# Altium schematic sheet POT 10x8.SchDoc
size D
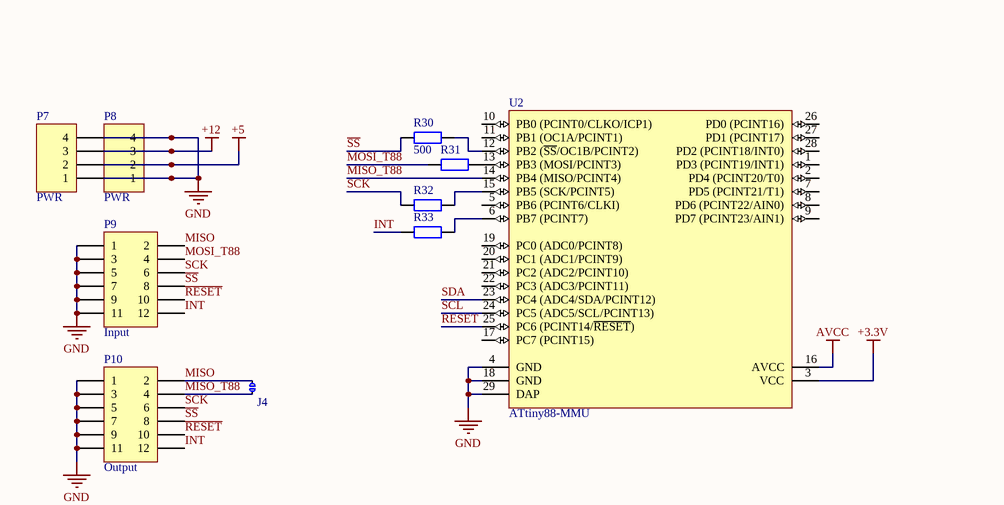
[diagram p0: POT 10x8.SchDoc, top left]
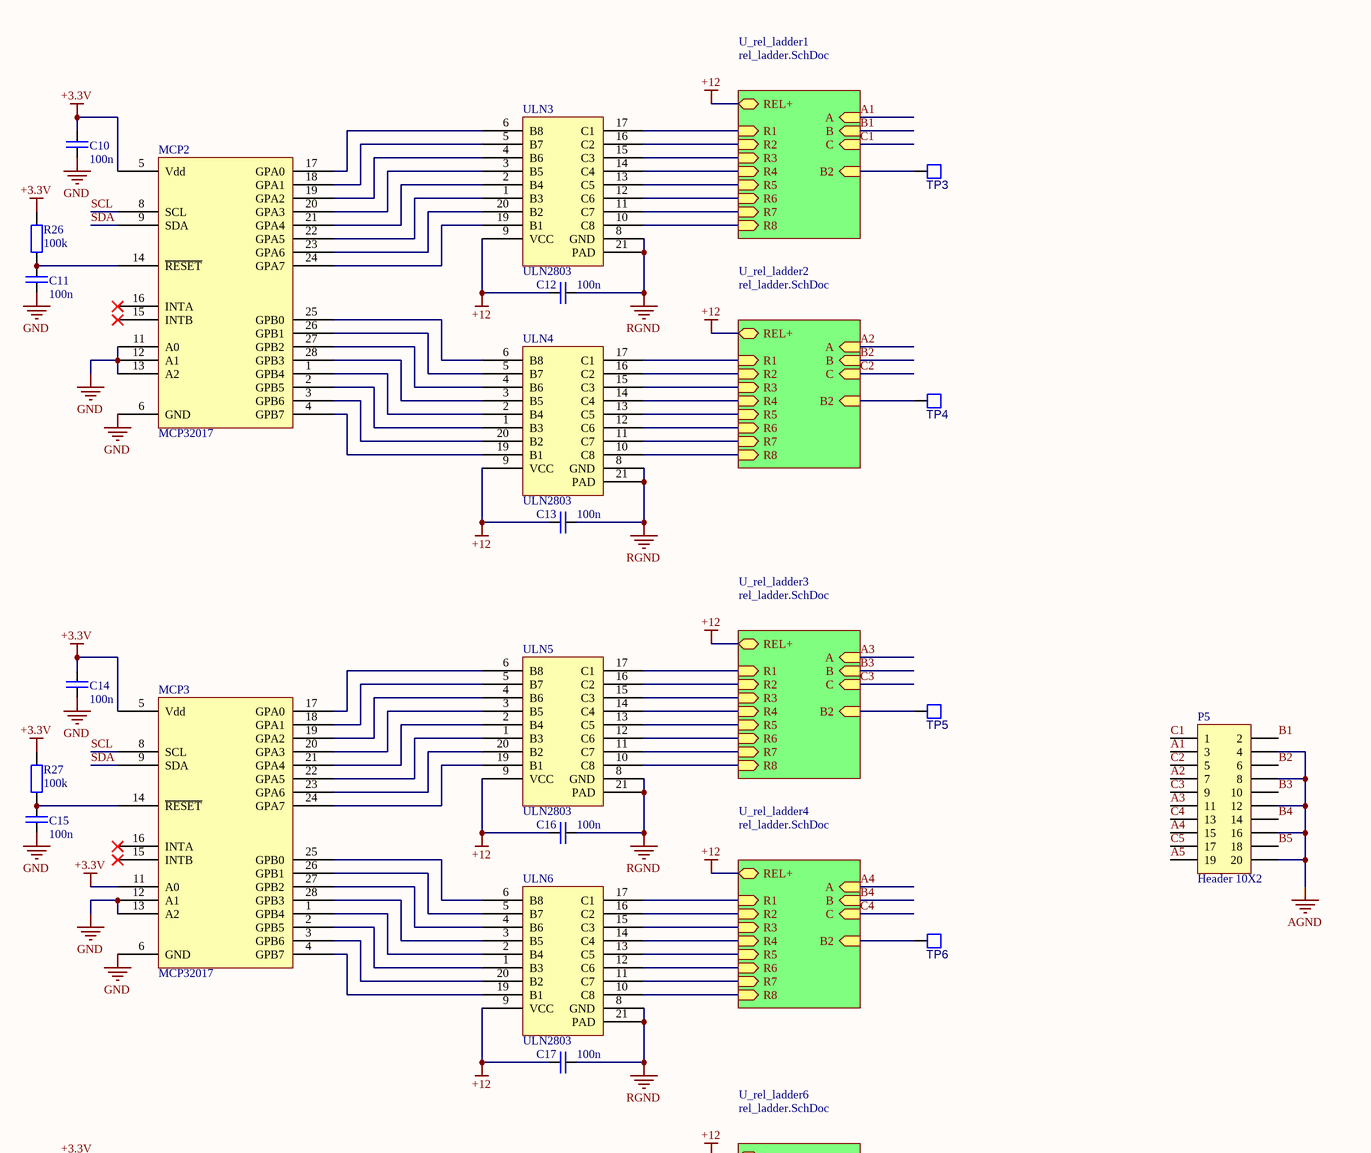
[diagram p1: POT 10x8.SchDoc, top right]
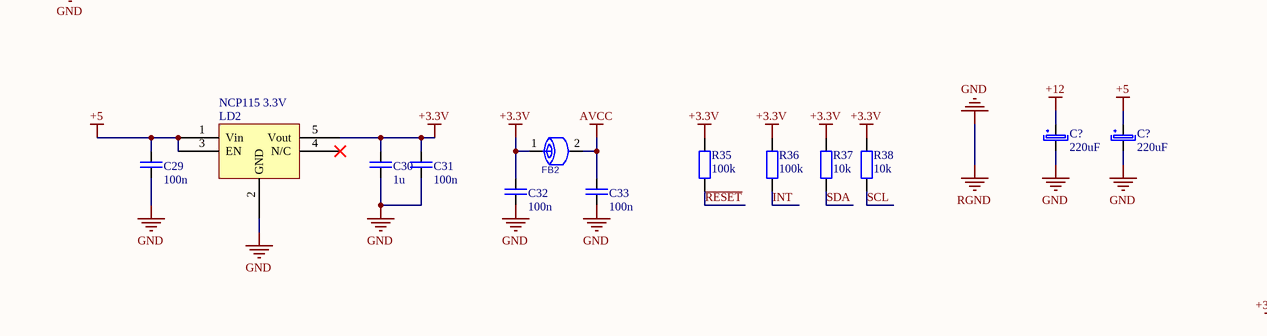
[diagram p2: POT 10x8.SchDoc, bottom left]
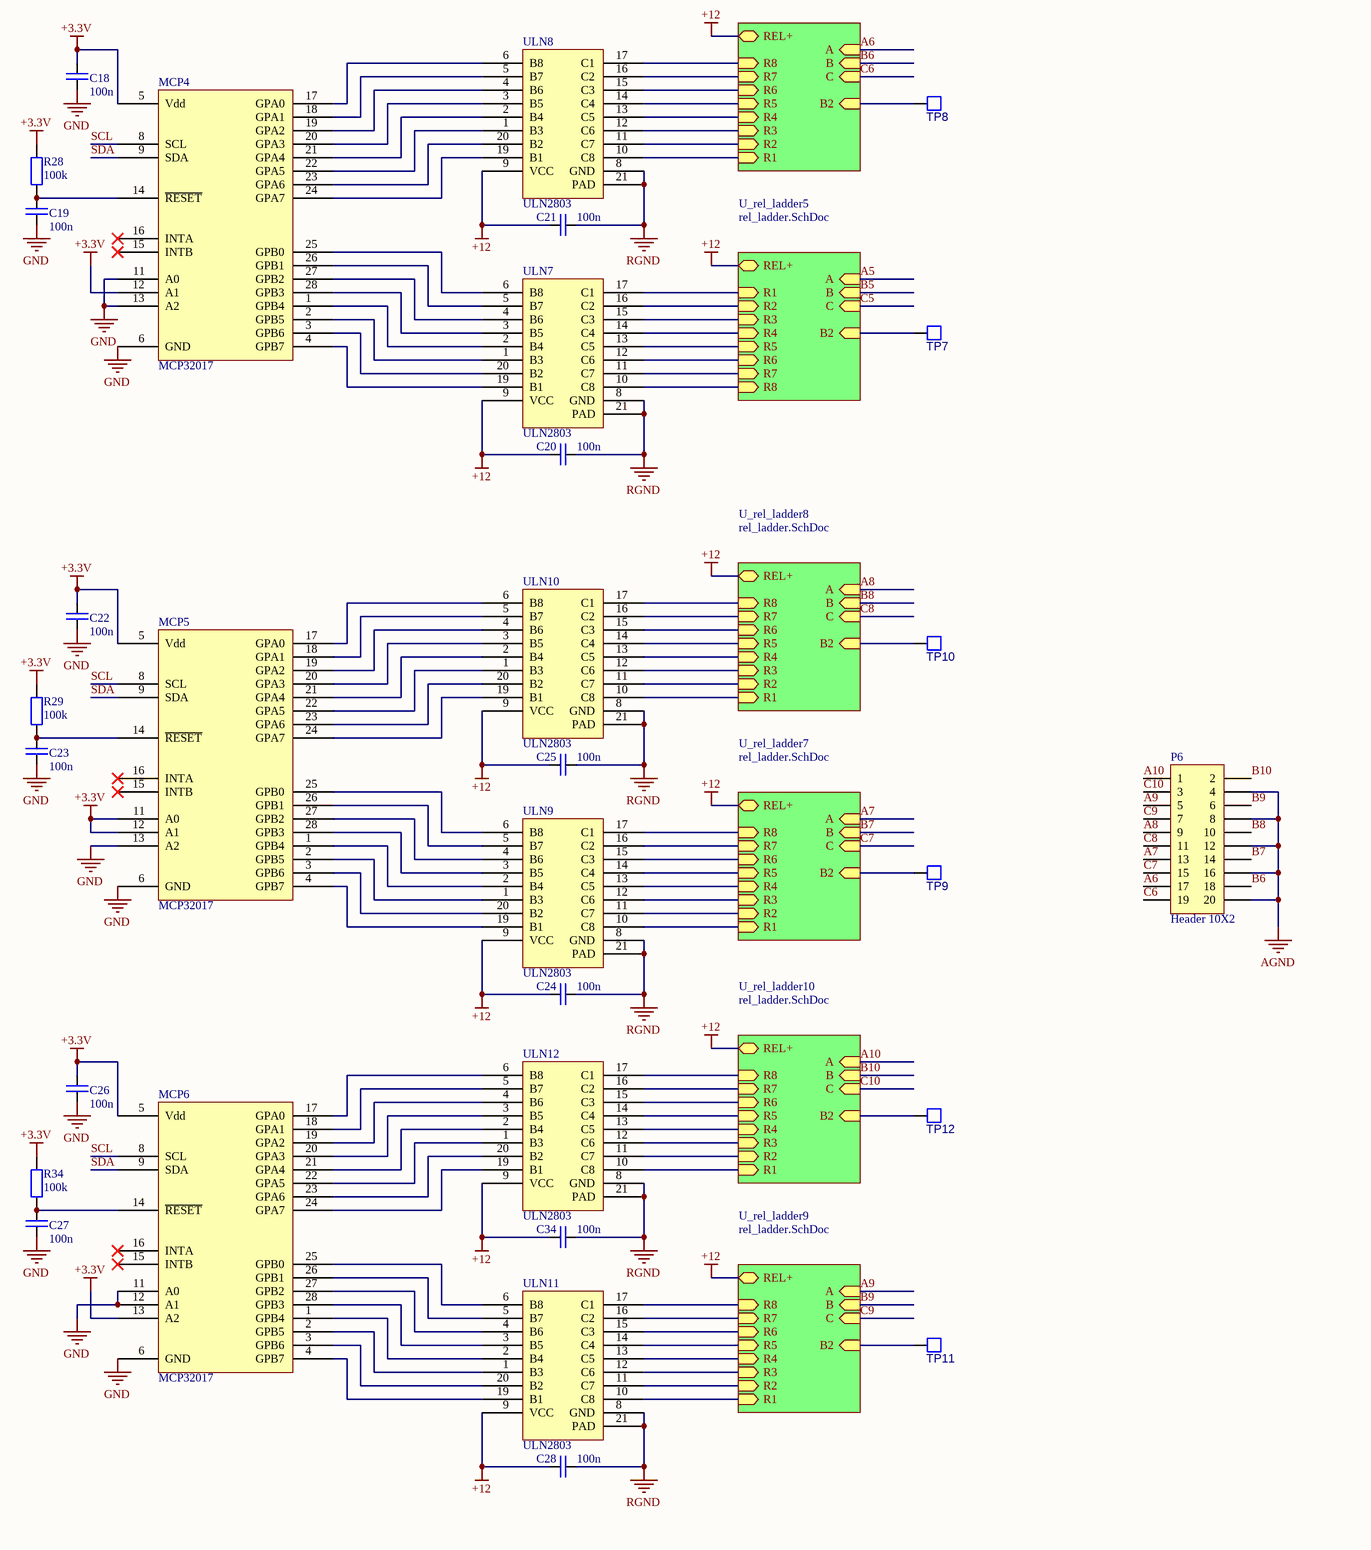
[diagram p3: POT 10x8.SchDoc, bottom right]

## Parts
(Parts that share a designator on the sheet are numbered #1, #2 ... from top to bottom, then left to right.)
C10  100n  [R1005_0402i_L]
C11  100n  [R1005_0402i_L]
C12  100n  [R1005_0402i_L]
C13  100n  [R1005_0402i_L]
C14  100n  [R1005_0402i_L]
C15  100n  [R1005_0402i_L]
C16  100n  [R1005_0402i_L]
C17  100n  [R1005_0402i_L]
C18  100n  [R1005_0402i_L]
C19  100n  [R1005_0402i_L]
C20  100n  [R1005_0402i_L]
C21  100n  [R1005_0402i_L]
C22  100n  [R1005_0402i_L]
C23  100n  [R1005_0402i_L]
C24  100n  [R1005_0402i_L]
C25  100n  [R1005_0402i_L]
C26  100n  [R1005_0402i_L]
C27  100n  [R1005_0402i_L]
C28  100n  [R1005_0402i_L]
C29  100n  [R1005_0402i_L]
C30  1u  [C1608_0603I_L]
C31  100n  [R1005_0402i_L]
C32  100n  [R1005_0402i_L]
C33  100n  [R1005_0402i_L]
C34  100n  [R1005_0402i_L]
C?#1  220uF  [C AlElko 5x11 R2]
C?#2  220uF  [C AlElko 5x11 R2]
FB2  FERITTE BEAD  [R1608_0603I_L]  (value not drawn)
J4  Terminator  [solderJumper]  (value not drawn)
LD2  NCP115 3.3V  [TSOP95P280X110-6L]
MCP2  MCP32017  [MCP23017 QFN]
MCP3  MCP32017  [MCP23017 QFN]
MCP4  MCP32017  [MCP23017 QFN]
MCP5  MCP32017  [MCP23017 QFN]
MCP6  MCP32017  [MCP23017 QFN]
P5  Header 10X2  [HDR2X10]
P6  Header 10X2  [HDR2X10]
P7  PWR  [HDR1X4]
P8  PWR  [HDR1X4]
P9  Input  [1.27mm SMD conn]
P10  Output  [1.27mm SMD conn]
R26  100k  [R1005_0402i_L]
R27  100k  [R1005_0402i_L]
R28  100k  [R1005_0402i_L]
R29  100k  [R1005_0402i_L]
R30  500  [R1005_0402i_L]
R31  500  [R1005_0402i_L]  (value not drawn)
R32  500  [R1005_0402i_L]  (value not drawn)
R33  500  [R1005_0402i_L]  (value not drawn)
R34  100k  [R1005_0402i_L]
R35  100k  [R1005_0402i_L]
R36  100k  [R1005_0402i_L]
R37  10k  [R1005_0402i_L]
R38  10k  [R1005_0402i_L]
TP3  PAD  [PAD_CIRC_HOLE]  (value not drawn)
TP4  PAD  [PAD_CIRC_HOLE]  (value not drawn)
TP5  PAD  [PAD_CIRC_HOLE]  (value not drawn)
TP6  PAD  [PAD_CIRC_HOLE]  (value not drawn)
TP7  PAD  [PAD_CIRC_HOLE]  (value not drawn)
TP8  PAD  [PAD_CIRC_HOLE]  (value not drawn)
TP9  PAD  [PAD_CIRC_HOLE]  (value not drawn)
TP10  PAD  [PAD_CIRC_HOLE]  (value not drawn)
TP11  PAD  [PAD_CIRC_HOLE]  (value not drawn)
TP12  PAD  [PAD_CIRC_HOLE]  (value not drawn)
U2  ATtiny88-MMU  [28M1_N]
ULN3  ULN2803  [QFN127P600-8N]
ULN4  ULN2803  [QFN127P600-8N]
ULN5  ULN2803  [QFN127P600-8N]
ULN6  ULN2803  [QFN127P600-8N]
ULN7  ULN2803  [QFN127P600-8N]
ULN8  ULN2803  [QFN127P600-8N]
ULN9  ULN2803  [QFN127P600-8N]
ULN10  ULN2803  [QFN127P600-8N]
ULN11  ULN2803  [QFN127P600-8N]
ULN12  ULN2803  [QFN127P600-8N]

## Sub-sheets
U_rel_ladder1 = rel_ladder.SchDoc: B (in), C (in), A (in), REL+ (bidir), R1 (in), R2 (in), R3 (in), R4 (in), R5 (in), R6 (in), R7 (in), R8 (in), B2 (in)
U_rel_ladder2 = rel_ladder.SchDoc: B (in), C (in), A (in), REL+ (bidir), R1 (in), R2 (in), R3 (in), R4 (in), R5 (in), R6 (in), R7 (in), R8 (in), B2 (in)
U_rel_ladder3 = rel_ladder.SchDoc: B (in), C (in), A (in), REL+ (bidir), R1 (in), R2 (in), R3 (in), R4 (in), R5 (in), R6 (in), R7 (in), R8 (in), B2 (in)
U_rel_ladder4 = rel_ladder.SchDoc: B (in), C (in), A (in), REL+ (bidir), R1 (in), R2 (in), R3 (in), R4 (in), R5 (in), R6 (in), R7 (in), R8 (in), B2 (in)
U_rel_ladder5 = rel_ladder.SchDoc: B (in), C (in), A (in), REL+ (bidir), R1 (in), R2 (in), R3 (in), R4 (in), R5 (in), R6 (in), R7 (in), R8 (in), B2 (in)
U_rel_ladder6 = rel_ladder.SchDoc: B (in), C (in), A (in), REL+ (bidir), R1 (in), R2 (in), R3 (in), R4 (in), R5 (in), R6 (in), R7 (in), R8 (in), B2 (in)
U_rel_ladder7 = rel_ladder.SchDoc: B (in), C (in), A (in), REL+ (bidir), R1 (in), R2 (in), R3 (in), R4 (in), R5 (in), R6 (in), R7 (in), R8 (in), B2 (in)
U_rel_ladder8 = rel_ladder.SchDoc: B (in), C (in), A (in), REL+ (bidir), R1 (in), R2 (in), R3 (in), R4 (in), R5 (in), R6 (in), R7 (in), R8 (in), B2 (in)
U_rel_ladder9 = rel_ladder.SchDoc: B (in), C (in), A (in), REL+ (bidir), R1 (in), R2 (in), R3 (in), R4 (in), R5 (in), R6 (in), R7 (in), R8 (in), B2 (in)
U_rel_ladder10 = rel_ladder.SchDoc: B (in), C (in), A (in), REL+ (bidir), R1 (in), R2 (in), R3 (in), R4 (in), R5 (in), R6 (in), R7 (in), R8 (in), B2 (in)

## Nets
+3.3V: C10.2 C14.2 C18.2 C22.2 C26.2 C30.1 C31.1 C32.1 FB2.1 LD2.5(Vout) MCP2.5(Vdd) MCP3.5(Vdd) MCP3.11(A0) MCP4.5(Vdd) MCP4.12(A1) MCP5.5(Vdd) MCP5.11(A0) MCP5.12(A1) MCP6.5(Vdd) MCP6.13(A2) R26.1 R27.1 R28.1 R29.1 R34.1 R35.1 R36.1 R37.1 R38.1 U2.3(VCC)
+5: C29.1 C?#2.1 LD2.1(Vin) LD2.3(EN) P7.2 P8.2
+12: C12.1 C13.1 C16.1 C17.1 C20.1 C21.1 C24.1 C25.1 C28.1 C34.1 C?#1.1 P7.3 P8.3 ULN3.9(VCC) ULN4.9(VCC) ULN5.9(VCC) ULN6.9(VCC) ULN7.9(VCC) ULN8.9(VCC) ULN9.9(VCC) ULN10.9(VCC) ULN11.9(VCC) ULN12.9(VCC) ; sheet U_rel_ladder1/REL+, sheet U_rel_ladder2/REL+, sheet U_rel_ladder3/REL+, sheet U_rel_ladder4/REL+, sheet U_rel_ladder5/REL+, sheet U_rel_ladder6/REL+, sheet U_rel_ladder7/REL+, sheet U_rel_ladder8/REL+, sheet U_rel_ladder9/REL+, sheet U_rel_ladder10/REL+
AGND: P5.4 P5.8 P5.12 P5.16 P5.20 P6.4 P6.8 P6.12 P6.16 P6.20
AVCC: C33.1 FB2.2 U2.16(AVCC)
GND: C10.1 C11.1 C12.2 C13.2 C14.1 C15.1 C16.2 C17.2 C18.1 C19.1 C20.2 C21.2 C22.1 C23.1 C24.2 C25.2 C26.1 C27.1 C28.2 C29.2 C30.2 C31.2 C32.2 C33.2 C34.2 C?#1.2 C?#2.2 LD2.2(GND) MCP2.6(GND) MCP2.11(A0) MCP2.12(A1) MCP2.13(A2) MCP3.6(GND) MCP3.12(A1) MCP3.13(A2) MCP4.6(GND) MCP4.11(A0) MCP4.13(A2) MCP5.6(GND) MCP5.13(A2) MCP6.6(GND) MCP6.11(A0) MCP6.12(A1) P7.1 P7.4 P8.1 P8.4 P9.1 P9.3 P9.5 P9.7 P9.9 P9.11 P10.1 P10.3 P10.5 P10.7 P10.9 P10.11 U2.4(GND) U2.18(GND) U2.29(DAP) ULN3.8(GND) ULN3.21(PAD) ULN4.8(GND) ULN4.21(PAD) ULN5.8(GND) ULN5.21(PAD) ULN6.8(GND) ULN6.21(PAD) ULN7.8(GND) ULN7.21(PAD) ULN8.8(GND) ULN8.21(PAD) ULN9.8(GND) ULN9.21(PAD) ULN10.8(GND) ULN10.21(PAD) ULN11.8(GND) ULN11.21(PAD) ULN12.8(GND) ULN12.21(PAD)  [also labelled RGND]
A1: P5.3 ; sheet U_rel_ladder1/A
A2: P5.7 ; sheet U_rel_ladder2/A
A3: P5.11 ; sheet U_rel_ladder3/A
A4: P5.15 ; sheet U_rel_ladder4/A
A5: P5.19 ; sheet U_rel_ladder5/A
A6: P6.17 ; sheet U_rel_ladder6/A
A7: P6.13 ; sheet U_rel_ladder7/A
A8: P6.9 ; sheet U_rel_ladder8/A
A9: P6.5 ; sheet U_rel_ladder9/A
A10: P6.1 ; sheet U_rel_ladder10/A
B1: P5.2 ; sheet U_rel_ladder1/B
B2: P5.6 ; sheet U_rel_ladder2/B
B3: P5.10 ; sheet U_rel_ladder3/B
B4: P5.14 ; sheet U_rel_ladder4/B
B5: P5.18 ; sheet U_rel_ladder5/B
B6: P6.18 ; sheet U_rel_ladder6/B
B7: P6.14 ; sheet U_rel_ladder7/B
B8: P6.10 ; sheet U_rel_ladder8/B
B9: P6.6 ; sheet U_rel_ladder9/B
B10: P6.2 ; sheet U_rel_ladder10/B
C1: P5.1 ; sheet U_rel_ladder1/C
C2: P5.5 ; sheet U_rel_ladder2/C
C3: P5.9 ; sheet U_rel_ladder3/C
C4: P5.13 ; sheet U_rel_ladder4/C
C5: P5.17 ; sheet U_rel_ladder5/C
C6: P6.19 ; sheet U_rel_ladder6/C
C7: P6.15 ; sheet U_rel_ladder7/C
C8: P6.11 ; sheet U_rel_ladder8/C
C9: P6.7 ; sheet U_rel_ladder9/C
C10: P6.3 ; sheet U_rel_ladder10/C
INT: P9.12 P10.12 R33.1 R36.2
MISO: J4.2 P9.2 P10.2
MISO_T88: J4.1 P10.4 U2.14(PB4_(MISO/PCINT4))
MOSI_T88: P9.4 R31.1
~{RESET}: P9.10 P10.10 R35.2 U2.25(PC6_(PCINT14/~{RESET}))
~{SS}: P9.8 P10.8 R30.1
SCK: P9.6 P10.6 R32.1
SCL: MCP2.8(SCL) MCP3.8(SCL) MCP4.8(SCL) MCP5.8(SCL) MCP6.8(SCL) R38.2 U2.24(PC5_(ADC5/SCL/PCINT13))
SDA: MCP2.9(SDA) MCP3.9(SDA) MCP4.9(SDA) MCP5.9(SDA) MCP6.9(SDA) R37.2 U2.23(PC4_(ADC4/SDA/PCINT12))
NetC11_2: C11.2 MCP2.14(~{RESET}) R26.2
NetC15_2: C15.2 MCP3.14(~{RESET}) R27.2
NetC19_2: C19.2 MCP4.14(~{RESET}) R28.2
NetC23_2: C23.2 MCP5.14(~{RESET}) R29.2
NetC27_2: C27.2 MCP6.14(~{RESET}) R34.2
NetMCP2_1: MCP2.1(GPB4) ULN4.2(B4)
NetMCP2_2: MCP2.2(GPB5) ULN4.1(B3)
NetMCP2_3: MCP2.3(GPB6) ULN4.20(B2)
NetMCP2_4: MCP2.4(GPB7) ULN4.19(B1)
NetMCP2_17: MCP2.17(GPA0) ULN3.6(B8)
NetMCP2_18: MCP2.18(GPA1) ULN3.5(B7)
NetMCP2_19: MCP2.19(GPA2) ULN3.4(B6)
NetMCP2_20: MCP2.20(GPA3) ULN3.3(B5)
NetMCP2_21: MCP2.21(GPA4) ULN3.2(B4)
NetMCP2_22: MCP2.22(GPA5) ULN3.1(B3)
NetMCP2_23: MCP2.23(GPA6) ULN3.20(B2)
NetMCP2_24: MCP2.24(GPA7) ULN3.19(B1)
NetMCP2_25: MCP2.25(GPB0) ULN4.6(B8)
NetMCP2_26: MCP2.26(GPB1) ULN4.5(B7)
NetMCP2_27: MCP2.27(GPB2) ULN4.4(B6)
NetMCP2_28: MCP2.28(GPB3) ULN4.3(B5)
NetMCP3_1: MCP3.1(GPB4) ULN6.2(B4)
NetMCP3_2: MCP3.2(GPB5) ULN6.1(B3)
NetMCP3_3: MCP3.3(GPB6) ULN6.20(B2)
NetMCP3_4: MCP3.4(GPB7) ULN6.19(B1)
NetMCP3_17: MCP3.17(GPA0) ULN5.6(B8)
NetMCP3_18: MCP3.18(GPA1) ULN5.5(B7)
NetMCP3_19: MCP3.19(GPA2) ULN5.4(B6)
NetMCP3_20: MCP3.20(GPA3) ULN5.3(B5)
NetMCP3_21: MCP3.21(GPA4) ULN5.2(B4)
NetMCP3_22: MCP3.22(GPA5) ULN5.1(B3)
NetMCP3_23: MCP3.23(GPA6) ULN5.20(B2)
NetMCP3_24: MCP3.24(GPA7) ULN5.19(B1)
NetMCP3_25: MCP3.25(GPB0) ULN6.6(B8)
NetMCP3_26: MCP3.26(GPB1) ULN6.5(B7)
NetMCP3_27: MCP3.27(GPB2) ULN6.4(B6)
NetMCP3_28: MCP3.28(GPB3) ULN6.3(B5)
NetMCP4_1: MCP4.1(GPB4) ULN7.2(B4)
NetMCP4_2: MCP4.2(GPB5) ULN7.1(B3)
NetMCP4_3: MCP4.3(GPB6) ULN7.20(B2)
NetMCP4_4: MCP4.4(GPB7) ULN7.19(B1)
NetMCP4_17: MCP4.17(GPA0) ULN8.6(B8)
NetMCP4_18: MCP4.18(GPA1) ULN8.5(B7)
NetMCP4_19: MCP4.19(GPA2) ULN8.4(B6)
NetMCP4_20: MCP4.20(GPA3) ULN8.3(B5)
NetMCP4_21: MCP4.21(GPA4) ULN8.2(B4)
NetMCP4_22: MCP4.22(GPA5) ULN8.1(B3)
NetMCP4_23: MCP4.23(GPA6) ULN8.20(B2)
NetMCP4_24: MCP4.24(GPA7) ULN8.19(B1)
NetMCP4_25: MCP4.25(GPB0) ULN7.6(B8)
NetMCP4_26: MCP4.26(GPB1) ULN7.5(B7)
NetMCP4_27: MCP4.27(GPB2) ULN7.4(B6)
NetMCP4_28: MCP4.28(GPB3) ULN7.3(B5)
NetMCP5_1: MCP5.1(GPB4) ULN9.2(B4)
NetMCP5_2: MCP5.2(GPB5) ULN9.1(B3)
NetMCP5_3: MCP5.3(GPB6) ULN9.20(B2)
NetMCP5_4: MCP5.4(GPB7) ULN9.19(B1)
NetMCP5_17: MCP5.17(GPA0) ULN10.6(B8)
NetMCP5_18: MCP5.18(GPA1) ULN10.5(B7)
NetMCP5_19: MCP5.19(GPA2) ULN10.4(B6)
NetMCP5_20: MCP5.20(GPA3) ULN10.3(B5)
NetMCP5_21: MCP5.21(GPA4) ULN10.2(B4)
NetMCP5_22: MCP5.22(GPA5) ULN10.1(B3)
NetMCP5_23: MCP5.23(GPA6) ULN10.20(B2)
NetMCP5_24: MCP5.24(GPA7) ULN10.19(B1)
NetMCP5_25: MCP5.25(GPB0) ULN9.6(B8)
NetMCP5_26: MCP5.26(GPB1) ULN9.5(B7)
NetMCP5_27: MCP5.27(GPB2) ULN9.4(B6)
NetMCP5_28: MCP5.28(GPB3) ULN9.3(B5)
NetMCP6_1: MCP6.1(GPB4) ULN11.2(B4)
NetMCP6_2: MCP6.2(GPB5) ULN11.1(B3)
NetMCP6_3: MCP6.3(GPB6) ULN11.20(B2)
NetMCP6_4: MCP6.4(GPB7) ULN11.19(B1)
NetMCP6_17: MCP6.17(GPA0) ULN12.6(B8)
NetMCP6_18: MCP6.18(GPA1) ULN12.5(B7)
NetMCP6_19: MCP6.19(GPA2) ULN12.4(B6)
NetMCP6_20: MCP6.20(GPA3) ULN12.3(B5)
NetMCP6_21: MCP6.21(GPA4) ULN12.2(B4)
NetMCP6_22: MCP6.22(GPA5) ULN12.1(B3)
NetMCP6_23: MCP6.23(GPA6) ULN12.20(B2)
NetMCP6_24: MCP6.24(GPA7) ULN12.19(B1)
NetMCP6_25: MCP6.25(GPB0) ULN11.6(B8)
NetMCP6_26: MCP6.26(GPB1) ULN11.5(B7)
NetMCP6_27: MCP6.27(GPB2) ULN11.4(B6)
NetMCP6_28: MCP6.28(GPB3) ULN11.3(B5)
NetR30_2: R30.2 U2.12(PB2_(~{SS}/OC1B/PCINT2))
NetR31_2: R31.2 U2.13(PB3_(MOSI/PCINT3))
NetR32_2: R32.2 U2.15(PB5_(SCK/PCINT5))
NetR33_2: R33.2 U2.6(PB7_(PCINT7))
NetTP3_1: TP3.1 ; sheet U_rel_ladder1/B2
NetTP4_1: TP4.1 ; sheet U_rel_ladder2/B2
NetTP5_1: TP5.1 ; sheet U_rel_ladder3/B2
NetTP6_1: TP6.1 ; sheet U_rel_ladder4/B2
NetTP7_1: TP7.1 ; sheet U_rel_ladder5/B2
NetTP8_1: TP8.1 ; sheet U_rel_ladder6/B2
NetTP9_1: TP9.1 ; sheet U_rel_ladder7/B2
NetTP10_1: TP10.1 ; sheet U_rel_ladder8/B2
NetTP11_1: TP11.1 ; sheet U_rel_ladder9/B2
NetTP12_1: TP12.1 ; sheet U_rel_ladder10/B2
NetULN3_10: ULN3.10(C8) ; sheet U_rel_ladder1/R8
NetULN3_11: ULN3.11(C7) ; sheet U_rel_ladder1/R7
NetULN3_12: ULN3.12(C6) ; sheet U_rel_ladder1/R6
NetULN3_13: ULN3.13(C5) ; sheet U_rel_ladder1/R5
NetULN3_14: ULN3.14(C4) ; sheet U_rel_ladder1/R4
NetULN3_15: ULN3.15(C3) ; sheet U_rel_ladder1/R3
NetULN3_16: ULN3.16(C2) ; sheet U_rel_ladder1/R2
NetULN3_17: ULN3.17(C1) ; sheet U_rel_ladder1/R1
NetULN4_10: ULN4.10(C8) ; sheet U_rel_ladder2/R8
NetULN4_11: ULN4.11(C7) ; sheet U_rel_ladder2/R7
NetULN4_12: ULN4.12(C6) ; sheet U_rel_ladder2/R6
NetULN4_13: ULN4.13(C5) ; sheet U_rel_ladder2/R5
NetULN4_14: ULN4.14(C4) ; sheet U_rel_ladder2/R4
NetULN4_15: ULN4.15(C3) ; sheet U_rel_ladder2/R3
NetULN4_16: ULN4.16(C2) ; sheet U_rel_ladder2/R2
NetULN4_17: ULN4.17(C1) ; sheet U_rel_ladder2/R1
NetULN5_10: ULN5.10(C8) ; sheet U_rel_ladder3/R8
NetULN5_11: ULN5.11(C7) ; sheet U_rel_ladder3/R7
NetULN5_12: ULN5.12(C6) ; sheet U_rel_ladder3/R6
NetULN5_13: ULN5.13(C5) ; sheet U_rel_ladder3/R5
NetULN5_14: ULN5.14(C4) ; sheet U_rel_ladder3/R4
NetULN5_15: ULN5.15(C3) ; sheet U_rel_ladder3/R3
NetULN5_16: ULN5.16(C2) ; sheet U_rel_ladder3/R2
NetULN5_17: ULN5.17(C1) ; sheet U_rel_ladder3/R1
NetULN6_10: ULN6.10(C8) ; sheet U_rel_ladder4/R8
NetULN6_11: ULN6.11(C7) ; sheet U_rel_ladder4/R7
NetULN6_12: ULN6.12(C6) ; sheet U_rel_ladder4/R6
NetULN6_13: ULN6.13(C5) ; sheet U_rel_ladder4/R5
NetULN6_14: ULN6.14(C4) ; sheet U_rel_ladder4/R4
NetULN6_15: ULN6.15(C3) ; sheet U_rel_ladder4/R3
NetULN6_16: ULN6.16(C2) ; sheet U_rel_ladder4/R2
NetULN6_17: ULN6.17(C1) ; sheet U_rel_ladder4/R1
NetULN7_10: ULN7.10(C8) ; sheet U_rel_ladder5/R8
NetULN7_11: ULN7.11(C7) ; sheet U_rel_ladder5/R7
NetULN7_12: ULN7.12(C6) ; sheet U_rel_ladder5/R6
NetULN7_13: ULN7.13(C5) ; sheet U_rel_ladder5/R5
NetULN7_14: ULN7.14(C4) ; sheet U_rel_ladder5/R4
NetULN7_15: ULN7.15(C3) ; sheet U_rel_ladder5/R3
NetULN7_16: ULN7.16(C2) ; sheet U_rel_ladder5/R2
NetULN7_17: ULN7.17(C1) ; sheet U_rel_ladder5/R1
NetULN8_10: ULN8.10(C8) ; sheet U_rel_ladder6/R1
NetULN8_11: ULN8.11(C7) ; sheet U_rel_ladder6/R2
NetULN8_12: ULN8.12(C6) ; sheet U_rel_ladder6/R3
NetULN8_13: ULN8.13(C5) ; sheet U_rel_ladder6/R4
NetULN8_14: ULN8.14(C4) ; sheet U_rel_ladder6/R5
NetULN8_15: ULN8.15(C3) ; sheet U_rel_ladder6/R6
NetULN8_16: ULN8.16(C2) ; sheet U_rel_ladder6/R7
NetULN8_17: ULN8.17(C1) ; sheet U_rel_ladder6/R8
NetULN9_10: ULN9.10(C8) ; sheet U_rel_ladder7/R1
NetULN9_11: ULN9.11(C7) ; sheet U_rel_ladder7/R2
NetULN9_12: ULN9.12(C6) ; sheet U_rel_ladder7/R3
NetULN9_13: ULN9.13(C5) ; sheet U_rel_ladder7/R4
NetULN9_14: ULN9.14(C4) ; sheet U_rel_ladder7/R5
NetULN9_15: ULN9.15(C3) ; sheet U_rel_ladder7/R6
NetULN9_16: ULN9.16(C2) ; sheet U_rel_ladder7/R7
NetULN9_17: ULN9.17(C1) ; sheet U_rel_ladder7/R8
NetULN10_10: ULN10.10(C8) ; sheet U_rel_ladder8/R1
NetULN10_11: ULN10.11(C7) ; sheet U_rel_ladder8/R2
NetULN10_12: ULN10.12(C6) ; sheet U_rel_ladder8/R3
NetULN10_13: ULN10.13(C5) ; sheet U_rel_ladder8/R4
NetULN10_14: ULN10.14(C4) ; sheet U_rel_ladder8/R5
NetULN10_15: ULN10.15(C3) ; sheet U_rel_ladder8/R6
NetULN10_16: ULN10.16(C2) ; sheet U_rel_ladder8/R7
NetULN10_17: ULN10.17(C1) ; sheet U_rel_ladder8/R8
NetULN11_10: ULN11.10(C8) ; sheet U_rel_ladder9/R1
NetULN11_11: ULN11.11(C7) ; sheet U_rel_ladder9/R2
NetULN11_12: ULN11.12(C6) ; sheet U_rel_ladder9/R3
NetULN11_13: ULN11.13(C5) ; sheet U_rel_ladder9/R4
NetULN11_14: ULN11.14(C4) ; sheet U_rel_ladder9/R5
NetULN11_15: ULN11.15(C3) ; sheet U_rel_ladder9/R6
NetULN11_16: ULN11.16(C2) ; sheet U_rel_ladder9/R7
NetULN11_17: ULN11.17(C1) ; sheet U_rel_ladder9/R8
NetULN12_10: ULN12.10(C8) ; sheet U_rel_ladder10/R1
NetULN12_11: ULN12.11(C7) ; sheet U_rel_ladder10/R2
NetULN12_12: ULN12.12(C6) ; sheet U_rel_ladder10/R3
NetULN12_13: ULN12.13(C5) ; sheet U_rel_ladder10/R4
NetULN12_14: ULN12.14(C4) ; sheet U_rel_ladder10/R5
NetULN12_15: ULN12.15(C3) ; sheet U_rel_ladder10/R6
NetULN12_16: ULN12.16(C2) ; sheet U_rel_ladder10/R7
NetULN12_17: ULN12.17(C1) ; sheet U_rel_ladder10/R8

Not connected (* = marked no-connect by the designer): LD2 4(N/C)*; MCP2 15(INTB)* 16(INTA)*; MCP3 15(INTB)* 16(INTA)*; MCP4 15(INTB)* 16(INTA)*; MCP5 15(INTB)* 16(INTA)*; MCP6 15(INTB)* 16(INTA)*; U2 1(PD3_(PCINT19/INT1)) 2(PD4_(PCINT20/T0)) 5(PB6_(PCINT6/CLKI)) 7(PD5_(PCINT21/T1)) 8(PD6_(PCINT22/AIN0)) 9(PD7_(PCINT23/AIN1)) 10(PB0_(PCINT0/CLKO/ICP1)) 11(PB1_(OC1A/PCINT1)) 17(PC7_(PCINT15)) 19(PC0_(ADC0/PCINT8)) 20(PC1_(ADC1/PCINT9)) 21(PC2_(ADC2/PCINT10)) 22(PC3_(ADC3/PCINT11)) 26(PD0_(PCINT16)) 27(PD1_(PCINT17)) 28(PD2_(PCINT18/INT0))

## Library data of the parts
C10-C34 = C: Capacitor
C?#1 C?#2 = C+: Capacitor Polarized
J4 = JMP_mini
P5 P6 = Header 10X2: Header, 10-Pin, Dual row; LatestRevisionDate: 17-Jul-2002; LatestRevisionNote: Re-released for DXP Platform.; Publisher: Altium Limited
P7 P8 = Header 4: Header, 4-Pin; LatestRevisionDate: 17-Jul-2002; LatestRevisionNote: Re-released for DXP Platform.; Publisher: Altium Limited
P9 P10 = Header 6X2: Header, 6-Pin, Dual row; LatestRevisionDate: 17-Jul-2002; LatestRevisionNote: Re-released for DXP Platform.; Publisher: Altium Limited
R26-R38 = R
U2 = ATtiny88-MMU: 8-bit AVR Microcontroller, 1.8-5.5V, 8KB Flash, 64 Bytes EEPROM, 512 Bytes SRAM, 28-pin MLF, Industrial Grade (-40°C to 85°C), Pb-Free; Published: 1-Apr-2010; DatasheetVersion: revC, Mar-2009; PackageVersion: revB, Nov-2008; PackageReference: 28M1; Publisher: Altium Limited; PackageDescription: 28-pad, 4x4x1.0mm Body, Pitch 0.45mm, 2.4x2.4mm Exposed Pad, Plastic Very Thin QFN Package (VQFN); Supplier 1: Digi-Key; Supplier Part Number 1: ATTINY88-MMU-ND; Supplier 2: Mouser; Supplier Part Number 2: 556-ATTINY88-MMU; ComponentLink1Description: Manufacturer Link; ComponentLink1URL: http://www.atmel.com/products/avr/default.asp?; ComponentLink2Description: ATtiny48/88 Datasheet; ComponentLink2URL: http://www.atmel.com/dyn/resources/prod_documents/doc8008.pdf; ComponentLink3Description: ATtiny48/88 Summary; ComponentLink3URL: http://www.atmel.com/dyn/resources/prod_documents/8008S.pdf; ComponentLink4Description: Atmel.com Home; ComponentLink4URL: http://www.atmel.com